# EAGLE design B131F (EAGLE 6.6.0)
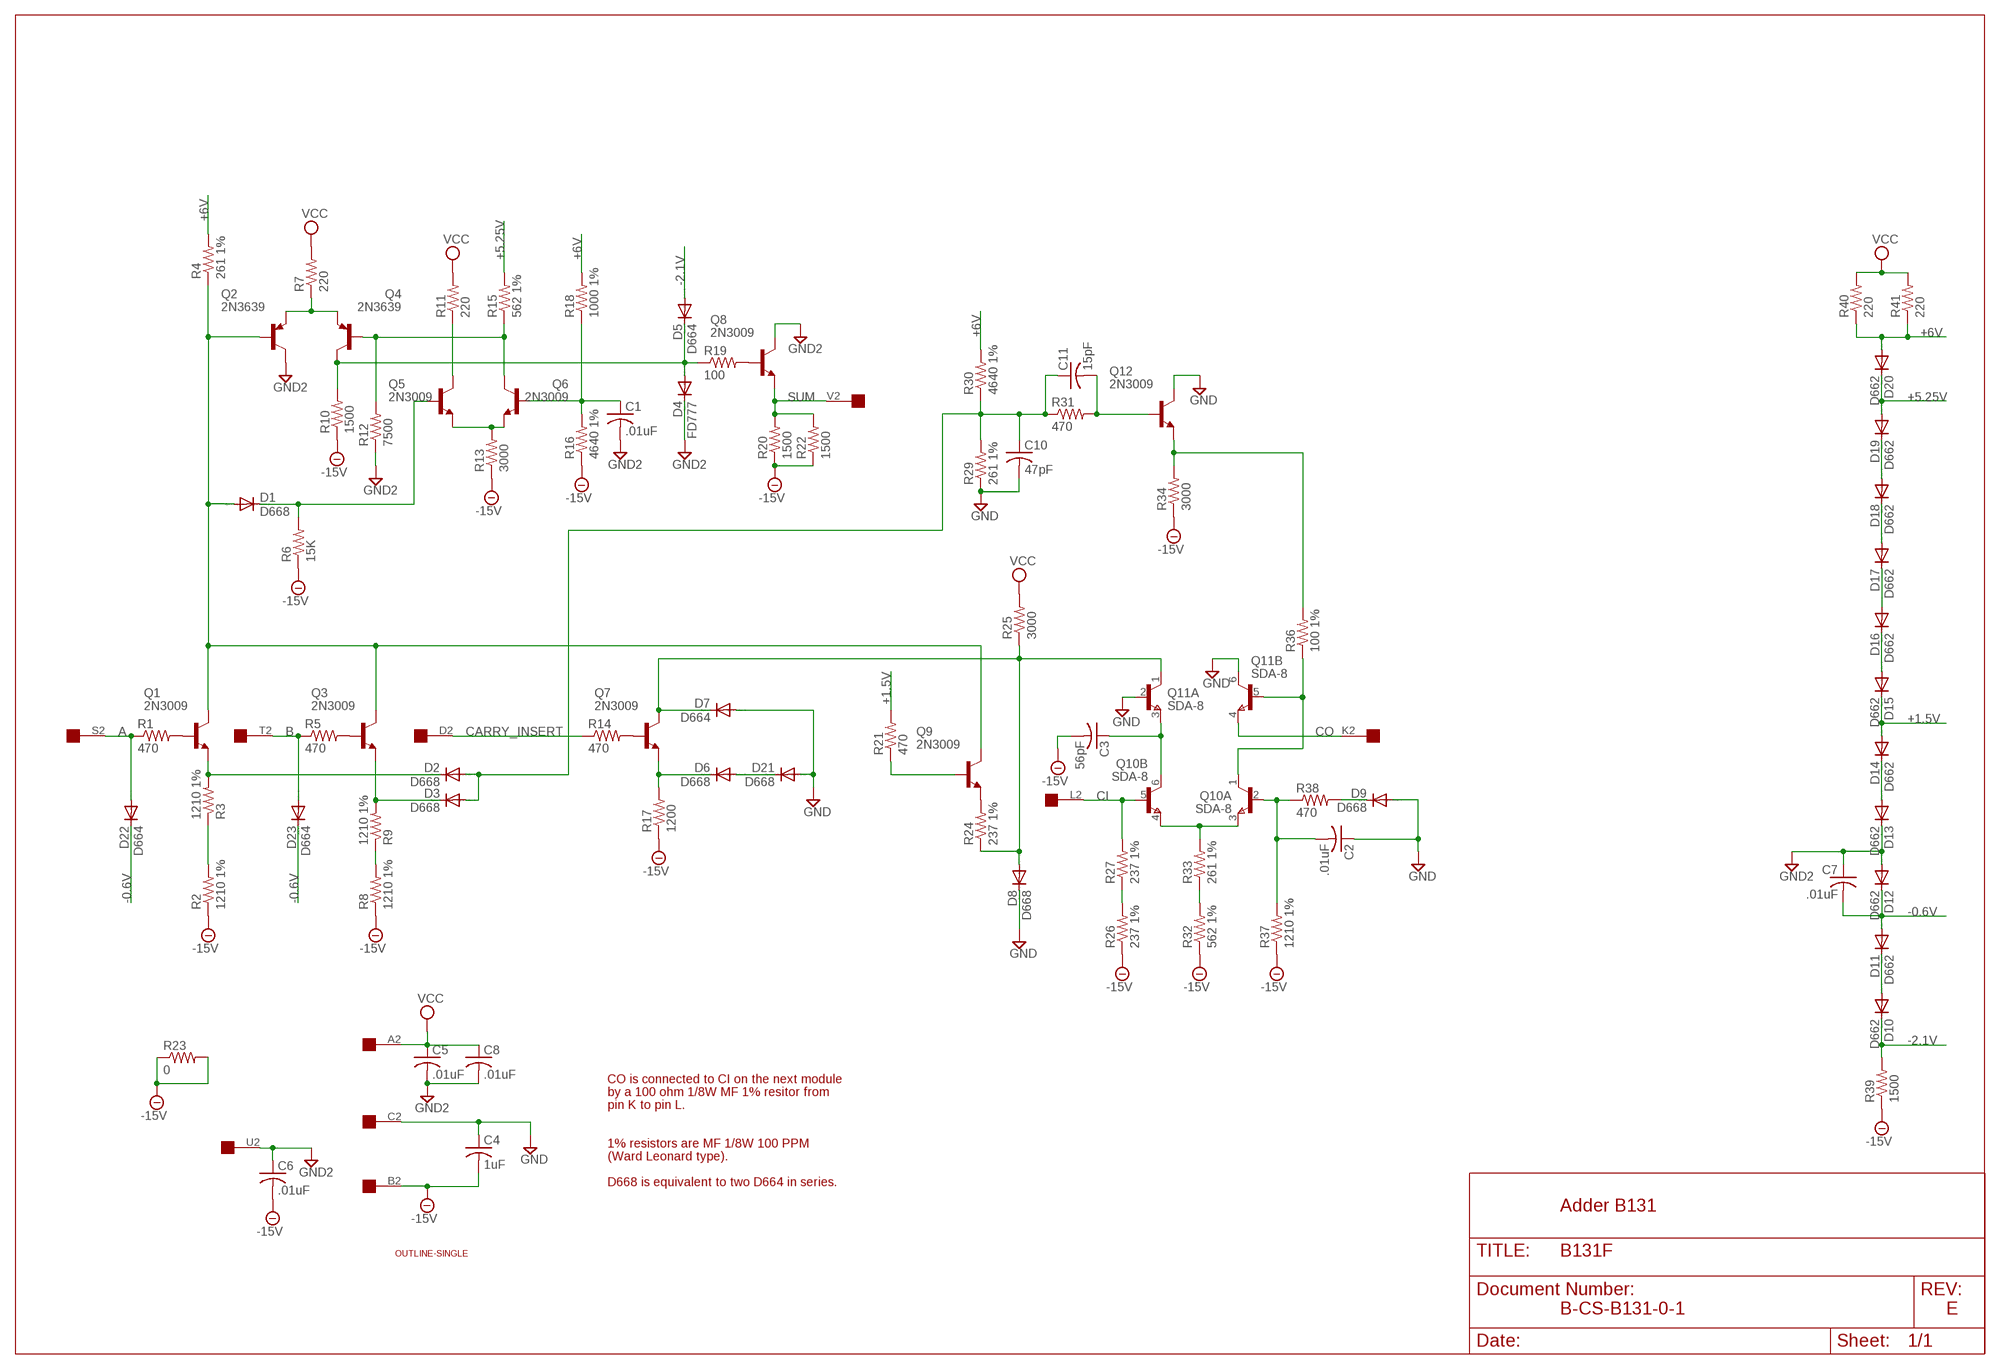
[diagram p0: schematic, sheet 1]

## Parts
C1  .01uF  C-US  [C063-025X075]
C2  .01uF  C-US  [C063-025X075]
C3  56pF  C-US  [C063-025X075]
C4  1uF  C-US102-043X133  [C102-043X133]
C5  .01uF  C-US  [C063-025X075]
C6  .01uF  C-US  [C063-025X075]
C7  .01uF  C-US  [C063-025X075]
C8  .01uF  C-US  [C063-025X075]
C10  47pF  C-US  [C063-025X075]
C11  15pF  C-US  [C063-025X075]
D1  D668  DIODE-DO35-10  [DO35-10]
D2  D668  DIODE-DO35-10  [DO35-10]
D3  D668  DIODE-DO35-10  [DO35-10]
D4  FD777  DIODE-DO35-10  [DO35-10]
D5  D664  DIODE-DO35-10  [DO35-10]
D6  D668  DIODE-DO35-10  [DO35-10]
D7  D664  DIODE-DO35-10  [DO35-10]
D8  D668  DIODE-DO35-10  [DO35-10]
D9  D668  DIODE-DO35-10  [DO35-10]
D10  D662  DIODE-DO35-10  [DO35-10]
D11  D662  DIODE-DO35-10  [DO35-10]
D12  D662  DIODE-DO35-10  [DO35-10]
D13  D662  DIODE-DO35-10  [DO35-10]
D14  D662  DIODE-DO35-10  [DO35-10]
D15  D662  DIODE-DO35-10  [DO35-10]
D16  D662  DIODE-DO35-10  [DO35-10]
D17  D662  DIODE-DO35-10  [DO35-10]
D18  D662  DIODE-DO35-10  [DO35-10]
D19  D662  DIODE-DO35-10  [DO35-10]
D20  D662  DIODE-DO35-10  [DO35-10]
D21  D668  DIODE-DO35-10  [DO35-10]
D22  D664  DIODE-DO35-10  [DO35-10]
D23  D664  DIODE-DO35-10  [DO35-10]
Q1  2N3009  -NPN-TO5  [TO5]
Q2  2N3639  -PNP-TO5  [TO5]
Q3  2N3009  -NPN-TO5  [TO5]
Q4  2N3639  -PNP-TO5  [TO5]
Q5  2N3009  -NPN-TO5  [TO5]
Q6  2N3009  -NPN-TO5  [TO5]
Q7  2N3009  -NPN-TO5  [TO5]
Q8  2N3009  -NPN-TO5  [TO5]
Q9  2N3009  -NPN-TO5  [TO5]
Q10  SDA-8  MAT-02H  [TO78]
Q11  SDA-8  MAT-02H  [TO78]
Q12  2N3009  -NPN-TO5  [TO5]
R1  470  R-US_0207/10  [0207/10]
R2  1210 1%  R-US_0207/15  [0207/15]
R3  1210 1%  R-US_0207/15  [0207/15]
R4  261 1%  R-US_0207/15  [0207/15]
R5  470  R-US_0207/10  [0207/10]
R6  15K  R-US_0207/10  [0207/10]
R7  220  R-US_0207/10  [0207/10]
R8  1210 1%  R-US_0207/15  [0207/15]
R9  1210 1%  R-US_0207/15  [0207/15]
R10  1500  R-US_0207/10  [0207/10]
R11  220  R-US_0207/10  [0207/10]
R12  7500  R-US_0207/10  [0207/10]
R13  3000  R-US_0207/10  [0207/10]
R14  470  R-US_0207/10  [0207/10]
R15  562 1%  R-US_0207/15  [0207/15]
R16  4640 1%  R-US_0207/15  [0207/15]
R17  1200  R-US_0207/10  [0207/10]
R18  1000 1%  R-US_0207/15  [0207/15]
R19  100  R-US_0207/10  [0207/10]
R20  1500  R-US_0207/10  [0207/10]
R21  470  R-US_0207/10  [0207/10]
R22  1500  R-US_0207/10  [0207/10]
R23  0  R-US_0207/10  [0207/10]
R24  237 1%  R-US_0207/15  [0207/15]
R25  3000  R-US_0207/10  [0207/10]
R26  237 1%  R-US_0207/15  [0207/15]
R27  237 1%  R-US_0207/15  [0207/15]
R29  261 1%  R-US_0207/15  [0207/15]
R30  4640 1%  R-US_0207/15  [0207/15]
R31  470  R-US_0207/10  [0207/10]
R32  562 1%  R-US_0207/15  [0207/15]
R33  261 1%  R-US_0207/15  [0207/15]
R34  3000  R-US_0207/10  [0207/10]
R36  100 1%  R-US_0207/15  [0207/15]
R37  1210 1%  R-US_0207/15  [0207/15]
R38  470  R-US_0207/10  [0207/10]
R39  1500  R-US_0207/10  [0207/10]
R40  220  R-US_0207/10  [0207/10]
R41  220  R-US_0207/10  [0207/10]
U$1  OUTLINE-SINGLE  [SINGLE]
U$2  EDGE-1  [EDGE-CON1]

## Nets
+1.5V: D14.A D15.C R21.2
+5.25V: D19.A D20.C R15.2
+6V: D20.A R4.2 R18.2 R30.2 R40.1 R41.1
-0.6V: C7.2 D11.A D12.C D22.C D23.C
-2.1V: D5.A D10.C R39.2
-15V: C3.2 C4.2 C6.2 R2.1 R6.1 R8.1 R10.1 R13.1 R16.1 R17.1 R20.1 R22.1 R23.1 R23.2 R26.1 R32.1 R34.1 R37.1 R39.1 U$2.B2
A: D22.A R1.1 U$2.S2
B: D23.A R5.1 U$2.T2
CARRY_INSERT: R14.1 U$2.D2
CI: Q10.5(B:B) R27.2 U$2.L2
CO: Q11.4(B:E) U$2.K2
GND: C2.1 C4.1 C10.2 D7.A D8.C D9.A D21.A Q11.2(A:B) Q11.6(B:C) Q12.3(C) R29.1 U$2.C2
GND2: C1.2 C5.2 C6.1 C7.1 C8.2 D4.C D12.A D13.C Q2.3(C) Q8.3(C) R12.1 U$2.U2
N$1: D1.A Q1.3(C) Q2.2(B) Q3.3(C) Q9.3(C) R4.1
N$2: D2.C Q1.1(E) R3.2
N$3: R2.2 R3.1
N$4: D3.C Q3.1(E) R9.2
N$5: R8.2 R9.1
N$6: Q1.2(B) R1.2
N$7: Q3.2(B) R5.2
N$9: C10.1 C11.1 D2.A D3.A R29.2 R30.1 R31.1
N$10: D6.C Q7.1(E) R17.2
N$11: Q7.2(B) R14.2
N$12: D6.A D21.C
N$13: D7.C D8.A Q7.3(C) Q11.1(A:C) R24.1 R25.1
N$15: Q9.1(E) R24.2
N$16: Q9.2(B) R21.1
N$17: Q10.3(A:E) Q10.4(B:E) R33.2
N$18: R32.2 R33.1
N$19: D17.A D18.C
N$20: D18.A D19.C
N$21: C3.1 Q10.6(B:C) Q11.3(A:E)
N$22: D15.A D16.C
N$23: D16.A D17.C
N$24: D13.A D14.C
N$25: Q10.1(A:C) Q11.5(B:B) R36.1
N$26: R26.2 R27.1
N$27: D10.A D11.C
N$28: C2.2 Q10.2(A:B) R37.2 R38.1
N$29: D9.C R38.2
N$30: Q2.1(E) Q4.1(E) R7.1
N$31: C1.1 Q6.2(B) R16.2 R18.1
N$32: Q5.1(E) Q6.1(E) R13.2
N$33: Q5.3(C) R11.1
N$34: Q4.2(B) Q6.3(C) R12.2 R15.1
N$35: D4.A D5.C Q4.3(C) R10.2 R19.1
N$36: D1.C Q5.2(B) R6.2
N$37: Q8.2(B) R19.2
N$38: C11.2 Q12.2(B) R31.2
N$39: Q12.1(E) R34.2 R36.2
SUM: Q8.1(E) R20.2 R22.2 U$2.V2
VCC: C5.1 C8.1 R7.2 R11.2 R25.2 R40.2 R41.2 U$2.A2
Unconnected: U$2.E2 U$2.F2 U$2.H2 U$2.J2 U$2.M2 U$2.N2 U$2.P2 U$2.R2

## Notes on the sheet
- CO is connected to CI on the next module
- by a 100 ohm 1/8W MF 1% resitor from
- pin K to pin L.
- 1% resistors are MF 1/8W 100 PPM
- (Ward Leonard type).
- D668 is equivalent to two D664 in series.
- Adder B131
- B-CS-B131-0-1 | E

## Library data of the parts
C1-C3 C5-C8 C10 C11 = dec-con:C-US: Capacitors with funky DEC lead spacing.
C4 = rcl:C-US: CAPACITOR, American symbol
D1-D23 = diode:DIODE-: DIODE
Q1 Q3 Q5-Q9 Q12 = transistor:*-NPN-: NPN Transistror BF959 corrected 2008.03.06
Q2 Q4 = transistor:*-PNP-: PNP Transistror
Q10 Q11 = linear:MAT-02H: Dual TRANSISTOR
R1-R27 R29-R34 R36-R41 = rcl:R-US_: RESISTOR, American symbol
U$1 = dec-con:OUTLINE-*: Board outlines for DEC boards.
U$2 = dec-con:EDGE-1: Single-Sided DEC Edge Connector -- (side 2)

## Net classes
0 default: width 0.813 mm

## Board
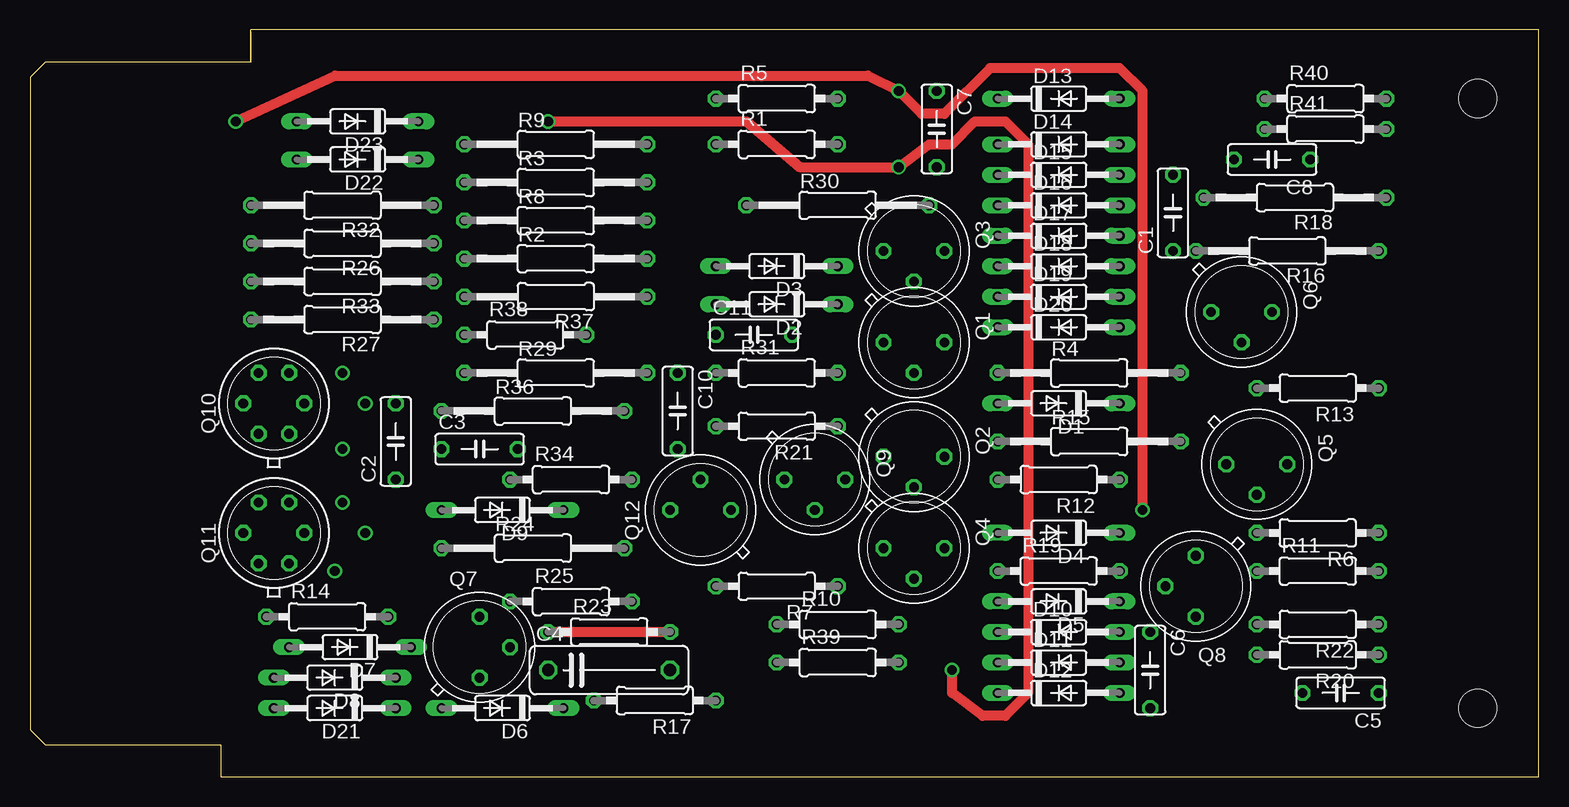
[diagram p1: board, top side]
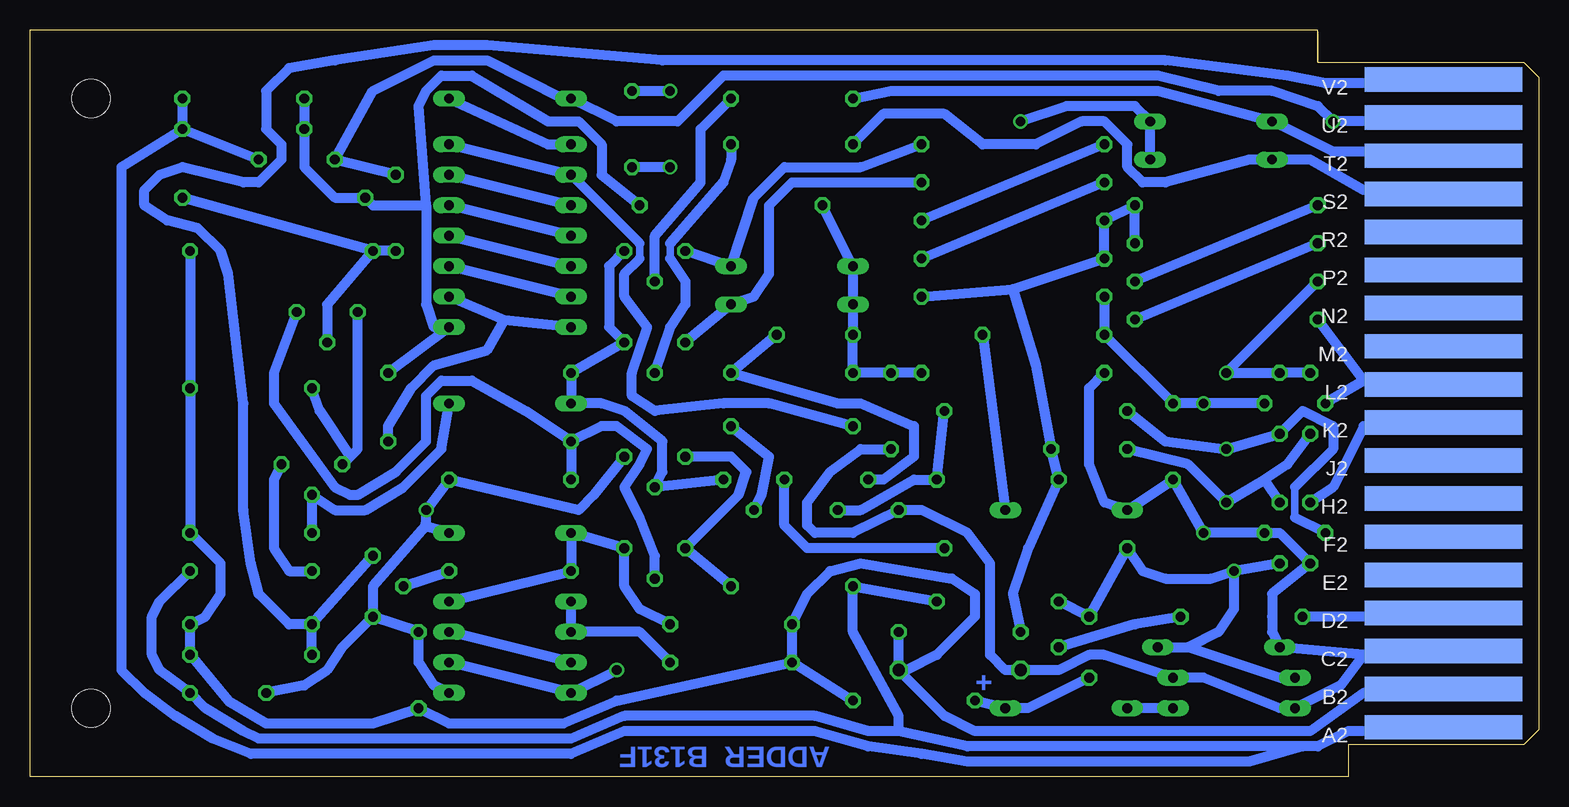
[diagram p2: board, bottom side, seen from below]

Size 125.73 x 62.23 mm. Coordinates in mm from the lower left corner, seen from the top.
Copper layers (1+16): Top 0.035mm / dielectric 1.5mm / Bottom 0.035mm
Design rules "16mils": minimum track width 16mil, minimum drill 32mil, track to track 15mil, track to pad 10mil, pad to pad 10mil, via to via 10mil, smd to smd 10mil, copper to edge 13mil, drill to drill 10mil, minimum pad ring 10mil, minimum via ring 8mil, stop-mask expansion 0mil, vias tented up to drill 0mil, thermal gap 10mil

### Footprints (pad centres in the part's own frame; a part is rotated, then mirrored left to right if it is on the bottom)
C063-025X075 = drill 0.813 octagon: 1 -2.54,0; 2 3.81,0
C102-043X133 = drill 1.016 octagon: 1 -5.08,0; 2 5.08,0
DO35-10 = drill 0.813 long: A 5.08,0; C -5.08,0
TO5 = drill 0.813 octagon: 1 0,-2.54; 2 2.54,0; 3 0,2.54
TO78 = drill 0.813 octagon: 1 -2.54,-1.27; 2 0,-2.54; 3 2.54,-1.27; 4 2.54,1.27; 5 0,2.54; 6 -2.54,1.27
0207/10 = drill 0.813 octagon: 1 -5.08,0; 2 5.08,0
0207/15 = drill 0.813 octagon: 1 -7.62,0; 2 7.62,0
SINGLE = hole 3.175: 120.65,56.515; 120.65,5.715
EDGE-CON1 = smd 13.106 x 2.032 bottom: A2 7.938,4.128; B2 7.938,7.303; C2 7.938,10.477; D2 7.938,13.652; E2 7.938,16.828; F2 7.938,20.003; H2 7.938,23.177; J2 7.938,26.352; K2 7.938,29.527; L2 7.938,32.703; M2 7.938,35.877; N2 7.938,39.053; P2 7.938,42.227; R2 7.938,45.403; S2 7.938,48.578; T2 7.938,51.752; U2 7.938,54.928; V2 7.938,58.102

### Placement (x,y rotation side)
C1  95.25,46.35 90 top
C2  30.48,27.3 90 top
C3  36.83,27.3 0 top
C4  48.26,8.89 0 top
C5  109.86,6.99 180 top
C6  93.35,9.53 270 top
C7  75.57,54.61 270 top
C8  104.14,51.44 180 top
C10  53.98,31.11 270 top
C11  59.69,36.83 0 top
D1  85.73,31.11 180 top
D2  62.23,39.37 180 top
D3  62.23,42.55 180 top
D4  85.73,20.32 180 top
D5  85.73,14.61 180 top
D6  39.37,5.71 180 top
D7  26.67,10.79 180 top
D8  25.4,8.26 180 top
D9  39.37,22.23 180 top
D10  85.73,12.06 0 top
D11  85.73,9.53 0 top
D12  85.73,6.99 0 top
D13  85.73,56.52 0 top
D14  85.73,52.7 0 top
D15  85.73,50.16 0 top
D16  85.73,47.62 0 top
D17  85.73,45.09 0 top
D18  85.73,42.55 0 top
D19  85.73,40.01 0 top
D20  85.73,37.47 0 top
D21  25.4,5.71 180 top
D22  27.31,51.44 180 top
D23  27.31,54.61 180 top
Q1  73.66,36.2 270 top
Q2  73.66,26.67 270 top
Q3  73.66,43.81 270 top
Q4  73.66,19.05 270 top
Q5  102.24,26.04 270 top
Q6  100.97,38.73 270 top
Q7  37.47,10.79 0 top
Q8  97.16,15.88 180 top
Q9  65.41,24.77 270 top
Q10  20.32,31.11 90 top
Q11  20.32,20.32 90 top
Q12  55.88,22.23 90 top
R1  62.23,52.7 0 top
R2  43.82,43.18 0 top
R3  43.82,49.53 0 top
R4  88.27,33.66 0 top
R5  62.23,56.52 0 top
R6  107.32,20.32 180 top
R7  62.23,15.88 180 top
R8  43.82,46.35 0 top
R9  43.82,52.7 0 top
R10  67.31,12.7 0 top
R11  107.32,17.14 0 top
R12  85.73,24.77 180 top
R13  107.32,32.38 180 top
R14  24.77,13.34 0 top
R15  88.27,27.94 0 top
R16  104.78,43.81 180 top
R17  52.07,6.35 180 top
R18  105.41,48.26 180 top
R19  85.73,17.14 0 top
R20  107.32,10.16 180 top
R21  62.23,29.21 180 top
R22  107.32,12.7 180 top
R23  48.26,12.06 0 top
R24  41.91,19.05 0 top
R25  45.09,14.61 0 top
R26  26.04,44.45 180 top
R27  26.04,38.1 180 top
R29  43.82,33.66 0 top
R30  67.31,47.62 0 top
R31  62.23,33.66 0 top
R32  26.04,47.62 180 top
R33  26.04,41.27 180 top
R34  45.09,24.77 0 top
R36  41.91,30.48 0 top
R37  43.82,40.01 180 top
R38  41.28,36.83 0 top
R39  67.31,9.53 0 top
R40  107.95,56.52 0 top
R41  107.95,53.98 0 top
U$1  0,0 0 top
U$2  0,0 0 top

### Tracks (layer width: path | path; a pad name or v marks a point on that pad's centre or on a via)
+1.5V
  Bottom 0.61: 74.93,43.18 74.93,44.45
  Bottom 0.813: R21.2 64.14,31.11 67.95,31.11 73.66,30.48 75.57,31.75 75.57,33.66 74.3,37.47 76.2,40.01 76.2,41.91 74.93,43.18 | 74.93,44.45 D15.C D14.A
+5.25V
  Bottom 0.813: D20.C 86.21,38.06 | 86.21,38.06 D19.A | R15.2 95.89,29.21 93.98,32.38 92.08,34.29 87.63,35.56 86.21,38.06
+6V
  Bottom 0.813: R40.1 R41.1 102.87,50.8 100.33,48.26 R18.2 97.16,47.62 92.71,47.62 | 92.71,47.62 93.35,55.88 92.71,57.15 91.44,58.42 88.9,58.42 82.55,54.61 80.01,54.61 78.11,52.7 78.11,50.16 R30.2 | 92.71,47.62 92.71,39.37 92.08,37.47 D20.A R4.2
-0.6V  (via drill 0.81)
  Top 0.813: v43.18,54.61 59.69,54.61 64.14,50.8 v72.39,50.8 74.93,52.7 76.84,52.7 78.74,54.61 81.28,54.61 83.19,52.7 83.19,6.99 81.28,5.08 79.38,5.08 76.84,6.99 v76.84,8.89
  Bottom 0.813: D11.A D12.C v76.84,8.89 | D22.C D23.C 33.66,55.88 39.37,55.88 v43.18,54.61 | v72.39,50.8 C7.2
-2.1V
  Bottom 0.813: R39.2 74.93,12.06 D10.C D5.A
-15V
  Top 0.813: R23.1 R23.2
  Bottom 0.813: U$2.B2 8.26,6.99 14.61,6.99 19.05,3.81 46.99,3.81 49.53,5.08 C4.2 | C4.2 R23.2 | R17.1 R39.1 | R39.1 R10.1 60.96,15.24 59.06,17.14 56.52,17.78 48.9,16.51 46.99,15.24 46.99,13.34 50.17,10.16 52.71,8.89 C4.2 | R26.1 R32.1 R8.1 R2.1 43.82,40.64 | R39.1 76.84,6.35 81.28,4.45 90.81,4.45 C6.2 97.16,4.45 106.05,4.45 109.22,6.35 R20.1 R22.1 111.13,13.34 109.86,15.24 109.86,17.78 R6.1 R13.1 R16.1 | R37.1 43.82,40.64 | 43.82,40.64 41.91,34.29 C3.2 R34.1 42.55,19.05 43.82,15.24 R23.1
A
  Bottom 0.813: U$2.S2 8.89,48.9 14.61,48.9 19.05,51.44 D22.A 24.13,51.44 31.12,49.53 33.02,49.53 34.29,50.8 34.29,52.7 36.2,54.61 38.1,54.61 41.91,52.7 46.36,52.7 49.53,55.24 54.61,55.24 R1.1
B
  Bottom 0.813: U$2.T2 9.53,52.07 17.15,52.07 D23.A 31.75,57.15 53.98,57.15 R5.1
CARRY_INSERT
  Bottom 0.813: U$2.D2 8.89,13.34 R14.1
CI
  Bottom 0.813: R27.2 14.61,33.02 | 14.61,33.02 8.89,33.02 U$2.L2 | 14.61,33.02 Q10.5
CO
  Bottom 0.813: U$2.K2 8.26,29.21 14.61,29.21 17.15,24.13 Q11.4
GND  (via drill 0.81)
  Bottom 0.813: C10.2 56.52,27.3 59.06,25.4 60.96,22.86 60.96,20.95 60.33,20.32 57.15,20.32 Q12.3 51.44,22.23 47.63,20.32 45.72,17.78 45.72,10.16 44.45,8.89 C4.1 40.01,8.89 37.47,10.16 36.2,10.16 D8.C 27.94,8.26 21.59,5.71 D21.A 16.51,7.62 14.61,10.16 | R29.1 37.47,32.38 37.47,26.04 36.2,22.86 D9.A C2.1 v27.94,20.32 Q11.2 21.59,20.32 Q11.6 22.23,15.24 22.23,13.34 22.23,12.06 D7.A 14.61,10.16 | U$2.C2 8.89,10.16 14.61,10.16
GND2  (via drill 0.81)
  Top 0.813: v92.71,22.23 92.71,57.15 90.81,59.05 80.01,59.05 76.2,55.24 74.3,55.24 v72.39,57.15 69.85,58.42 25.4,58.42 v17.15,54.61
  Bottom 0.813: Q8.3 99.7,10.79 100.97,8.89 102.87,7.62 C5.2 | Q2.3 78.74,23.5 80.01,22.23 R12.1 v92.71,22.23 92.78,20.87 | 92.78,20.87 97.16,15.88 Q8.3 | D4.C 92.78,20.87 | D12.A 92.08,7.62 93.35,9.53 C6.1 Q8.3 | U$2.U2 8.26,54.61 v17.15,54.61 18.42,55.88 22.23,57.15 26.67,57.15 31.75,58.42 67.95,58.42 71.76,54.61 76.84,54.61 D13.C 81.28,56.52 87.63,59.69 92.08,59.69 97.16,57.15 C8.2 C1.2 | C7.1 v72.39,57.15
N$1
  Bottom 0.813: Q9.3 Q2.2 73.03,25.4 73.03,27.94 76.2,30.48 78.11,31.11 D1.A R4.1 Q1.3 77.47,37.47 77.47,42.55 Q3.3
N$2
  Bottom 0.813: Q1.1 D2.C 65.41,40.01 64.14,41.91 64.14,47.62 62.23,49.53 R3.2
N$3
  Bottom 0.813: R3.1 R2.2
N$4
  Bottom 0.813: Q3.1 D3.C 65.41,48.26 62.87,50.8 56.52,50.8 R9.2
N$5
  Bottom 0.813: R9.1 R8.2
N$6
  Bottom 0.61: 72.39,44.45 72.39,43.18
  Bottom 0.813: R1.2 67.31,51.44 67.95,49.53 72.39,44.45 | 72.39,43.18 71.12,41.27 71.12,39.37 72.39,37.47 Q1.2
N$7
  Bottom 0.813: Q3.2 73.66,45.09 69.85,49.53 69.85,53.98 R5.2
N$9
  Bottom 0.813: R29.2 C10.1 R31.1 C11.1 D2.A D3.A R30.1
N$10
  Bottom 0.813: Q7.1 42.55,5.71 D6.C R17.2
N$11
  Bottom 0.813: R14.2 33.66,12.7 Q7.2
N$12
  Bottom 0.813: D21.C D6.A
N$13  (via drill 0.81)
  Bottom 0.813: v25.4,17.14 27.31,16.51 31.12,16.51 33.02,17.14 R24.1 Q7.3 R25.1 | v25.4,17.14 25.4,13.97 26.67,12.06 29.21,10.79 | D7.C 29.21,10.79 | 29.21,10.79 21.59,8.26 D8.A | Q11.1 v25.4,17.14
N$15
  Bottom 0.813: R24.2 60.96,19.05 62.87,20.95 Q9.1
N$16
  Bottom 0.813: Q9.2 64.77,23.5 64.14,26.67 R21.1
N$17  (via drill 0.81)
  Bottom 0.813: Q10.4 Q10.3 v26.04,33.66 R33.2
N$18
  Bottom 0.813: R32.2 R33.1
N$19
  Bottom 0.813: D17.A D18.C
N$20
  Bottom 0.813: D19.C D18.A
N$21  (via drill 0.81)
  Bottom 0.813: Q10.6 20.96,26.04 22.86,24.77 | 22.86,24.77 v26.04,22.86 29.21,26.04 C3.1 | 22.86,24.77 Q11.3
N$22
  Bottom 0.813: D15.A D16.C
N$23
  Bottom 0.813: D17.C D16.A
N$24
  Bottom 0.813: D13.A 82.55,52.7 D14.C
N$25  (via drill 0.81)
  Bottom 0.61: 20.32,24.13 20.32,21.59
  Bottom 0.813: Q11.5 20.32,21.59 | R36.1 31.12,27.94 v26.04,27.3 Q10.1 19.69,30.48 17.15,29.21 17.15,27.3 20.32,24.13
N$26
  Bottom 0.813: R26.2 R27.1
N$27
  Bottom 0.813: D11.C D10.A
N$28  (via drill 0.81)
  Bottom 0.813: Q10.2 v27.94,31.11 C2.2 R38.1 R37.2
N$29
  Bottom 0.813: R38.2 D9.C
N$30
  Bottom 0.813: R7.1 Q4.1 66.68,23.5 66.04,25.4 67.31,26.67 Q2.1
N$31
  Bottom 0.813: R16.2 R18.1 | R16.2 100.97,39.37 Q6.2 | C1.1 R16.2
N$32
  Bottom 0.813: R13.2 101.6,30.48 99.06,26.67 Q5.1 98.43,27.3 Q6.1
N$33
  Bottom 0.813: Q5.3 105.41,24.77 105.41,19.05 104.14,17.14 R11.1
N$34
  Bottom 0.813: Q4.2 73.66,18.41 74.93,21.59 76.2,24.13 74.93,26.04 74.3,27.3 76.84,29.21 78.11,29.21 R15.1 | R15.1 R12.2 | Q6.3 105.41,33.66 105.41,31.11 100.33,24.13 99.06,23.5 98.43,23.5 95.25,25.4 92.71,27.94 92.71,31.75 91.44,33.02 88.9,33.02 84.46,30.48 R15.1
N$35
  Bottom 0.813: D5.C R19.1 D4.A Q4.3 76.2,15.88 74.93,13.97 R10.2
N$36
  Bottom 0.813: R6.2 Q5.2 100.33,22.23 97.79,22.23 94.62,24.13 91.44,27.3 D1.C
N$37
  Bottom 0.813: Q8.2 R19.2
N$38
  Bottom 0.813: C11.2 R31.2 58.42,31.11 56.52,31.11 52.07,29.21 52.07,26.67 54.61,24.77 Q12.2
N$39
  Bottom 0.813: Q12.1 56.52,22.23 52.07,24.77 R34.2 R36.2
SUM
  Bottom 0.813: U$2.V2 8.26,57.78 17.78,57.78 20.96,58.42 31.12,59.69 73.03,59.69 87.63,60.96 90.81,60.96 92.08,60.96 100.33,59.69 104.14,59.05 106.05,57.15 106.05,53.98 104.78,52.7 104.78,51.44 106.68,49.53 107.95,49.53 113.03,50.8 114.94,50.16 116.21,48.9 116.21,47.62 114.3,46.35 111.76,45.72 109.86,43.81 109.22,41.91 107.95,31.11 107.95,22.23 107.32,17.78 106.68,15.24 104.14,12.7 R22.2 | R20.2 R22.2 | Q8.1 R22.2
VCC
  Bottom 0.813: U$2.A2 8.26,3.81 15.88,3.81 18.42,2.54 19.69,2.54 | 19.69,2.54 24.13,1.27 47.63,1.27 51.44,1.91 55.88,2.54 60.33,3.81 76.2,3.81 80.65,1.91 107.32,1.91 110.49,3.17 113.67,5.08 116.21,6.99 118.11,8.89 118.11,50.8 R41.2 | 53.34,3.81 55.88,3.81 60.33,5.08 76.2,5.08 80.65,3.17 106.68,3.17 107.95,3.81 111.13,5.71 C5.1 114.94,8.89 115.57,10.16 115.57,13.34 114.94,14.61 R11.2 | 53.34,3.81 53.34,5.08 57.15,12.06 R7.2 R25.2 | R40.2 R41.2 | C8.1 R41.2 | 19.69,2.54 47.63,2.54 53.34,3.81

### Text on the board
Bottom: + | ADDER | B131F